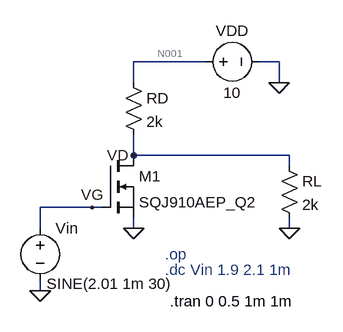
[diagram p0: schematic mos_cs_vgs.asc]
mos_cs_vgs.asc, the LTspice schematic file:
Version 4.1
SHEET 1 880 680
WIRE 288 -16 176 -16
WIRE 400 -16 368 -16
WIRE 176 16 176 -16
WIRE 400 16 400 -16
WIRE 176 128 176 96
WIRE 416 128 176 128
WIRE 176 144 176 128
WIRE 416 144 416 128
WIRE 112 208 32 208
WIRE 128 208 112 208
WIRE 32 240 32 208
WIRE 176 240 176 224
WIRE 416 240 416 224
WIRE 32 336 32 320
FLAG 176 240 0
FLAG 176 128 VD
FLAG 400 16 0
FLAG 32 336 0
FLAG 416 240 0
FLAG 112 208 VG
SYMBOL nmos 128 128 R0
SYMATTR InstName M1
SYMATTR Value SQJ910AEP_Q2
SYMBOL voltage 272 -16 R270
WINDOW 0 32 56 VTop 2
WINDOW 3 -32 56 VBottom 2
WINDOW 123 0 0 Left 0
WINDOW 39 0 0 Left 0
SYMATTR InstName VDD
SYMATTR Value 10
SYMBOL voltage 32 224 R0
WINDOW 123 0 0 Left 0
WINDOW 39 0 0 Left 0
WINDOW 3 10 101 Left 2
SYMATTR InstName Vin
SYMATTR Value SINE(2.01 1m 30)
SYMBOL res 160 0 R0
SYMATTR InstName RD
SYMATTR Value 2k
SYMBOL res 400 128 R0
SYMATTR InstName RL
SYMATTR Value 2k
TEXT 224 280 Left 2 ;.op
TEXT 224 304 Left 2 ;.dc Vin 1.9 2.1 1m
TEXT 232 352 Left 2 !.tran 0 0.5 1m 1m

The netlist it stands for:
* mos_cs_vgs.asc
M1 VD VG 0 0 SQJ910AEP_Q2
VDD N001 0 10
Vin VG 0 SINE(2.01 1m 30)
RD N001 VD 2k
RL VD 0 2k
.model NMOS NMOS
.model PMOS PMOS
.lib standard.mos
* .op
* .dc Vin 1.9 2.1 1m
.tran 0 0.5 1m 1m
.backanno
.end

* Results of the author's LTspice run, read from the files saved beside the schematic
* Operating Point, zero values left out:
*   V(vg) = 2.01 V
*   V(vd) = 1.922 V
*   V(n001) = 10 V
*   Id(M1) = 3.078 mA
*   Is(M1) = -3.078 mA
*   I(RL) = 961.2 µA
*   I(VDD) = -4.039 mA
*   I(RD) = 4.039 mA
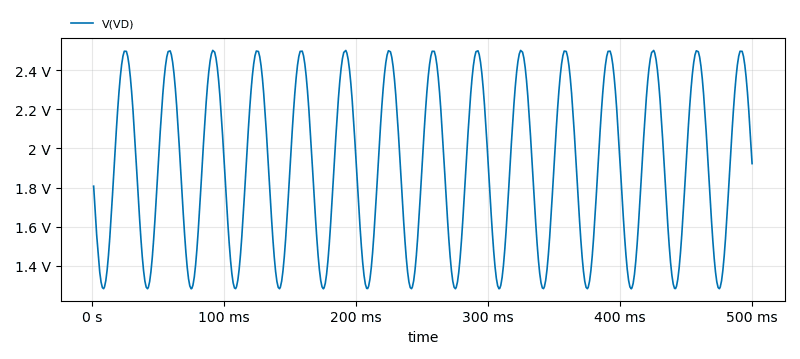
[diagram p1: Transient Analysis of mos_cs_vgs.asc, plotted from the saved traces]
* Transient Analysis, 1 run:
*   V(VD): min 1.283 V, max 2.501 V, average 1.907 V, rms 1.956 V, last 1.923 V